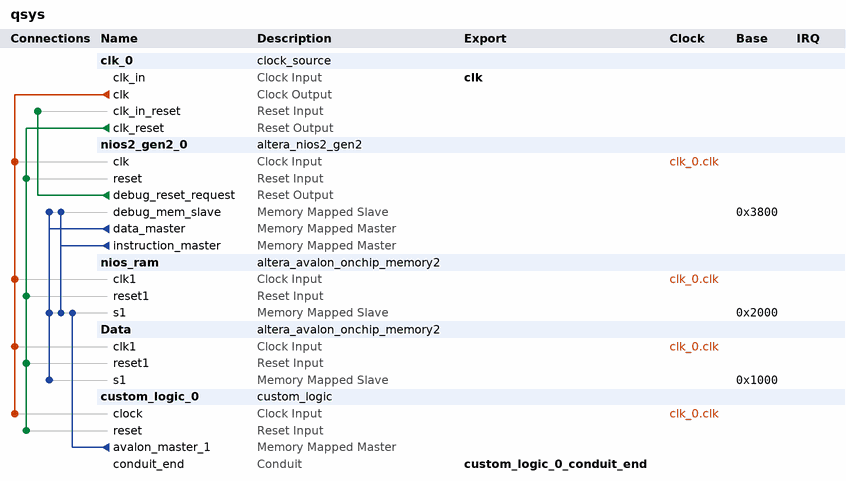
[diagram p0: system contents]
# Platform Designer (Qsys) system qsys, Cyclone V 5CSXFC6D6F31C6
# Parameters at their usual value, and those the tool derives, are not listed.
package require -exact qsys 17.1
create_system qsys
set_project_property DEVICE_FAMILY {Cyclone V}
set_project_property DEVICE 5CSXFC6D6F31C6

add_instance clk_0 clock_source 17.1
set_instance_parameter_value clk_0 clockFrequency 50000000

add_instance nios2_gen2_0 altera_nios2_gen2 17.1
set_instance_parameter_value nios2_gen2_0 dcache_size 2048
set_instance_parameter_value nios2_gen2_0 exceptionSlave nios_ram.s1
set_instance_parameter_value nios2_gen2_0 icache_size 4096
set_instance_parameter_value nios2_gen2_0 impl Tiny
set_instance_parameter_value nios2_gen2_0 resetSlave nios_ram.s1

add_instance nios_ram altera_avalon_onchip_memory2 17.1
set_instance_parameter_value nios_ram dataWidth 32
set_instance_parameter_value nios_ram dualPort false
set_instance_parameter_value nios_ram initMemContent true
set_instance_parameter_value nios_ram initializationFileName onchip_mem.hex
set_instance_parameter_value nios_ram memorySize 4096

add_instance Data altera_avalon_onchip_memory2 17.1
set_instance_parameter_value Data dataWidth 32
set_instance_parameter_value Data dualPort false
set_instance_parameter_value Data initMemContent true
set_instance_parameter_value Data initializationFileName onchip_mem.hex
set_instance_parameter_value Data memorySize 4096

add_instance custom_logic_0 custom_logic 1.0

# connections
add_connection clk_0.clk custom_logic_0.clock clock
add_connection clk_0.clk Data.clk1 clock
add_connection clk_0.clk nios2_gen2_0.clk clock
add_connection clk_0.clk nios_ram.clk1 clock
add_connection clk_0.clk_reset custom_logic_0.reset reset
add_connection clk_0.clk_reset Data.reset1 reset
add_connection clk_0.clk_reset nios2_gen2_0.reset reset
add_connection clk_0.clk_reset nios_ram.reset1 reset
add_connection nios2_gen2_0.debug_reset_request clk_0.clk_in_reset reset
add_connection custom_logic_0.avalon_master_1 nios_ram.s1 avalon
set_connection_parameter_value custom_logic_0.avalon_master_1/nios_ram.s1 baseAddress 0x2000
add_connection nios2_gen2_0.data_master Data.s1 avalon
set_connection_parameter_value nios2_gen2_0.data_master/Data.s1 baseAddress 0x1000
add_connection nios2_gen2_0.data_master nios2_gen2_0.debug_mem_slave avalon
set_connection_parameter_value nios2_gen2_0.data_master/nios2_gen2_0.debug_mem_slave baseAddress 0x3800
add_connection nios2_gen2_0.data_master nios_ram.s1 avalon
set_connection_parameter_value nios2_gen2_0.data_master/nios_ram.s1 baseAddress 0x2000
add_connection nios2_gen2_0.instruction_master nios2_gen2_0.debug_mem_slave avalon
set_connection_parameter_value nios2_gen2_0.instruction_master/nios2_gen2_0.debug_mem_slave baseAddress 0x3800
add_connection nios2_gen2_0.instruction_master nios_ram.s1 avalon
set_connection_parameter_value nios2_gen2_0.instruction_master/nios_ram.s1 baseAddress 0x2000

# exported interfaces
add_interface clk clock sink
set_interface_property clk EXPORT_OF clk_0.clk_in
add_interface custom_logic_0_conduit_end conduit end
set_interface_property custom_logic_0_conduit_end EXPORT_OF custom_logic_0.conduit_end

set_interconnect_requirement {$system} qsys_mm.clockCrossingAdapter HANDSHAKE
set_interconnect_requirement {$system} qsys_mm.enableEccProtection FALSE
set_interconnect_requirement {$system} qsys_mm.insertDefaultSlave FALSE
set_interconnect_requirement {$system} qsys_mm.maxAdditionalLatency 1

save_system qsys.qsys
